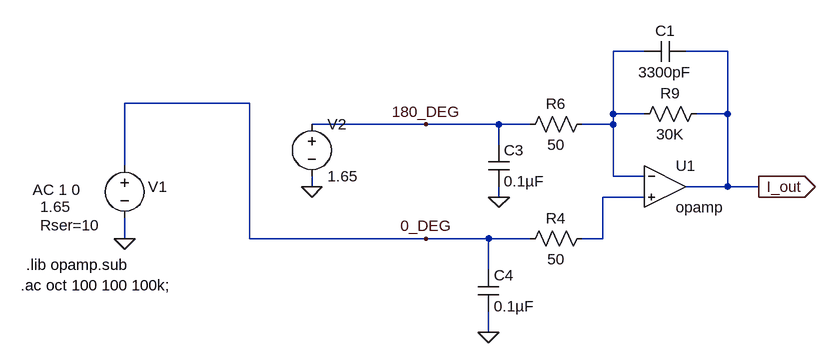
[diagram p0: schematic audio-amplifier.asc]
audio-amplifier.asc, the LTspice schematic file:
Version 4
SHEET 1 2336 848
WIRE 32 -160 -16 -160
WIRE 160 -160 96 -160
WIRE -576 -80 -768 -80
WIRE -16 -64 -16 -160
WIRE 32 -64 -16 -64
WIRE 160 -64 160 -160
WIRE 160 -64 112 -64
WIRE -304 -48 -480 -48
WIRE -192 -48 -304 -48
WIRE -144 -48 -192 -48
WIRE -16 -48 -16 -64
WIRE -16 -48 -64 -48
WIRE -192 -16 -192 -48
WIRE -768 16 -768 -80
WIRE -16 32 -16 -48
WIRE 32 32 -16 32
WIRE -480 48 -480 32
WIRE 160 48 160 -64
WIRE 160 48 96 48
WIRE 208 48 160 48
WIRE -192 64 -192 48
WIRE 32 64 -32 64
WIRE -768 128 -768 96
WIRE -576 128 -576 -80
WIRE -304 128 -576 128
WIRE -208 128 -304 128
WIRE -144 128 -208 128
WIRE -32 128 -32 64
WIRE -32 128 -64 128
WIRE -208 176 -208 128
WIRE -208 272 -208 240
FLAG -304 128 0_DEG
FLAG -304 -48 180_DEG
FLAG -192 64 0
FLAG -208 272 0
FLAG -768 128 0
FLAG -480 48 0
FLAG 208 48 I_out
IOPIN 208 48 Out
SYMBOL res -48 112 R90
WINDOW 0 0 56 VBottom 2
WINDOW 3 32 56 VTop 2
SYMATTR InstName R4
SYMATTR Value 50
SYMATTR SpiceLine tol=1
SYMBOL res -48 -64 R90
WINDOW 0 0 56 VBottom 2
WINDOW 3 32 56 VTop 2
SYMATTR InstName R6
SYMATTR Value 50
SYMATTR SpiceLine tol=1]
SYMBOL cap 96 -176 R90
WINDOW 0 0 32 VBottom 2
WINDOW 3 32 32 VTop 2
SYMATTR InstName C1
SYMATTR Value 3300pF
SYMBOL cap -208 -16 R0
SYMATTR InstName C3
SYMATTR Value 0.1µF
SYMBOL cap -224 176 R0
SYMATTR InstName C4
SYMATTR Value 0.1µF
SYMBOL res 128 -80 R90
WINDOW 0 0 56 VBottom 2
WINDOW 3 32 56 VTop 2
SYMATTR InstName R9
SYMATTR Value 30K
SYMATTR SpiceLine tol=1
SYMBOL voltage -768 0 R0
WINDOW 123 -142 53 Left 2
WINDOW 39 -130 107 Left 2
WINDOW 3 -130 79 Left 2
WINDOW 0 36 48 Left 2
SYMATTR Value2 AC 1 0
SYMATTR SpiceLine Rser=10
SYMATTR Value 1.65
SYMATTR InstName V1
SYMBOL OpAmps/opamp 64 -16 R0
SYMATTR InstName U1
SYMBOL voltage -480 -64 R0
SYMATTR InstName V2
SYMATTR Value 1.65
SYMATTR SpiceLine Rser=10
TEXT -928 200 Left 2 !.ac oct 100 100 100k;
TEXT -920 168 Left 2 !.lib opamp.sub

The netlist it stands for:
* audio-amplifier.asc
R4 N002 0_DEG 50 tol=1
R6 N001 180_DEG 50 tol=1]
C1 I_out N001 3300pF
C3 180_DEG 0 0.1µF
C4 0_DEG 0 0.1µF
R9 I_out N001 30K tol=1
V1 0_DEG 0 1.65 AC 1 0 Rser=10
XU1 N001 N002 I_out opamp Aol=100K GBW=10Meg  ; pins invin noninvin out
V2 180_DEG 0 1.65 Rser=10
.ac oct 100 100 100k;
.lib opamp.sub
.backanno
.end